# EAGLE design IVPSUALT (EAGLE 5.07)
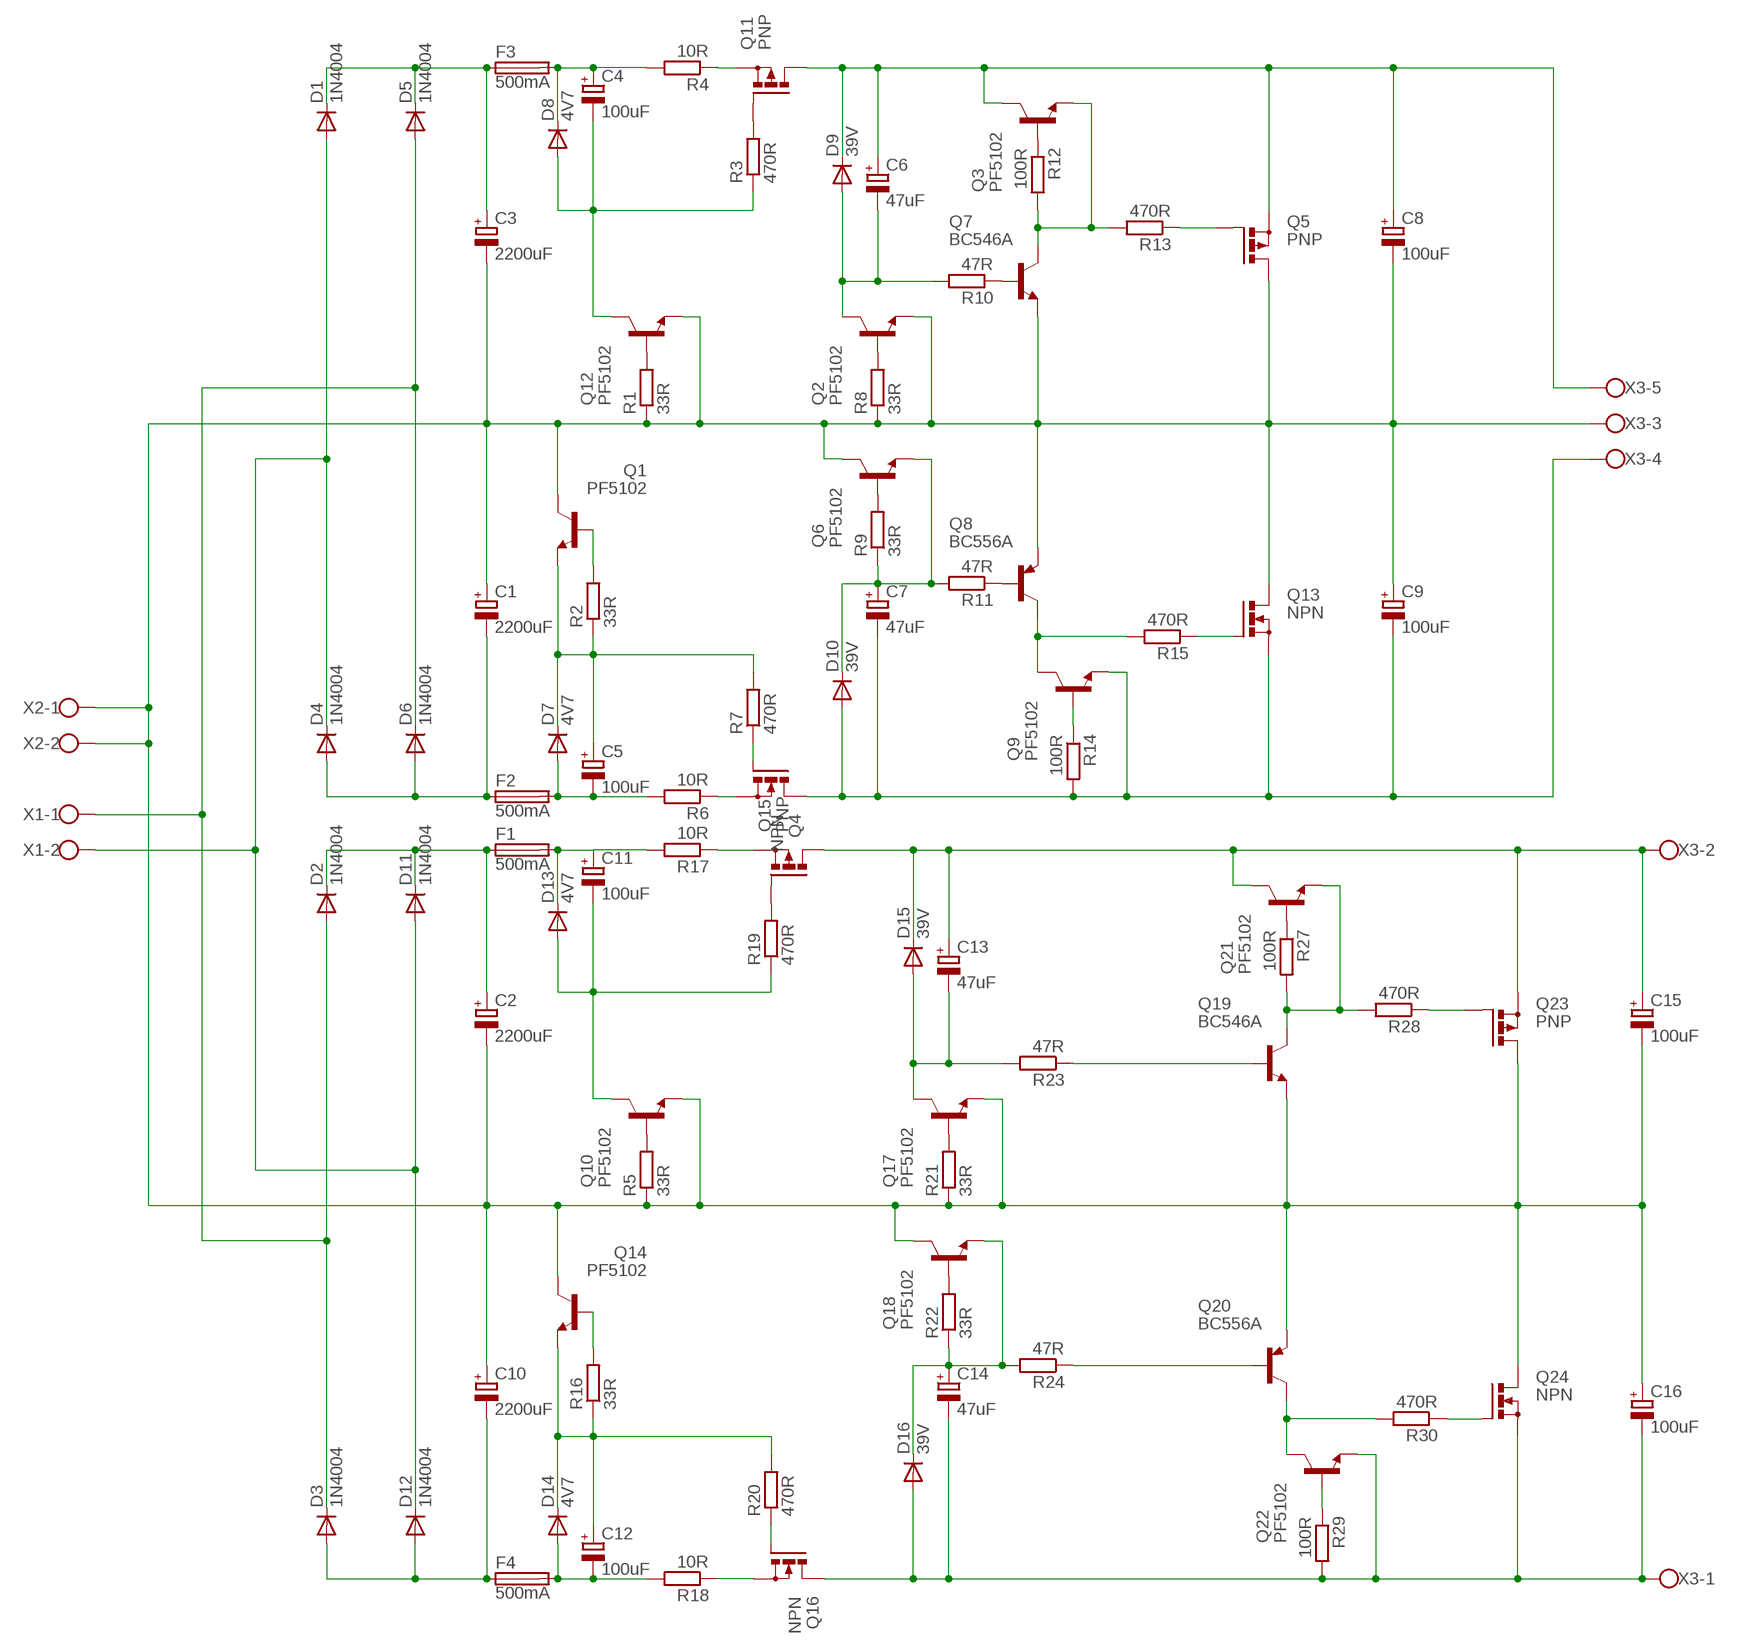
[diagram p0: schematic, sheet 1]

## Parts
C1  2200uF  CPOL-EUE7.5-18  [E7,5-18]
C2  2200uF  CPOL-EUE7.5-18  [E7,5-18]
C3  2200uF  CPOL-EUE7.5-18  [E7,5-18]
C4  100uF  CPOL-EUE3.5-8  [E3,5-8]
C5  100uF  CPOL-EUE3.5-8  [E3,5-8]
C6  47uF  CPOL-EUE3.5-8  [E3,5-8]
C7  47uF  CPOL-EUE3.5-8  [E3,5-8]
C8  100uF  CPOL-EUE7.5-18  [E7,5-18]
C9  100uF  CPOL-EUE7.5-18  [E7,5-18]
C10  2200uF  CPOL-EUE7.5-18  [E7,5-18]
C11  100uF  CPOL-EUE3.5-8  [E3,5-8]
C12  100uF  CPOL-EUE3.5-8  [E3,5-8]
C13  47uF  CPOL-EUE3.5-8  [E3,5-8]
C14  47uF  CPOL-EUE3.5-8  [E3,5-8]
C15  100uF  CPOL-EUE7.5-18  [E7,5-18]
C16  100uF  CPOL-EUE7.5-18  [E7,5-18]
D1  1N4004  [DO41-10]
D2  1N4004  [DO41-10]
D3  1N4004  [DO41-10]
D4  1N4004  [DO41-10]
D5  1N4004  [DO41-10]
D6  1N4004  [DO41-10]
D7  4V7  1N4004  [DO41-10]
D8  4V7  1N4004  [DO41-10]
D9  39V  1N4004  [DO41-10]
D10  39V  1N4004  [DO41-10]
D11  1N4004  [DO41-10]
D12  1N4004  [DO41-10]
D13  4V7  1N4004  [DO41-10]
D14  4V7  1N4004  [DO41-10]
D15  39V  1N4004  [DO41-10]
D16  39V  1N4004  [DO41-10]
F1  500mA  19560  [19560]
F2  500mA  19560  [19560]
F3  500mA  19560  [19560]
F4  500mA  19560  [19560]
Q1  PF5102  BCX59SMD  [TO92-EBC]
Q2  PF5102  BCX59SMD  [TO92-EBC]
Q3  PF5102  BCX59SMD  [TO92-EBC]
Q4  NPN  PMOSFET_NTO220BH  [TO220BH]
Q5  PNP  PMOSFET_PTO220BH  [TO220BH]
Q6  PF5102  BCX59SMD  [TO92-EBC]
Q7  BC546A  BC550B  [TO92-EBC]
Q8  BC556A  BC560  [TO92-EBC]
Q9  PF5102  BCX59SMD  [TO92-EBC]
Q10  PF5102  BCX59SMD  [TO92-EBC]
Q11  PNP  PMOSFET_PTO220BH  [TO220BH]
Q12  PF5102  BCX59SMD  [TO92-EBC]
Q13  NPN  PMOSFET_NTO220BH  [TO220BH]
Q14  PF5102  BCX59SMD  [TO92-EBC]
Q15  PNP  PMOSFET_PTO220BH  [TO220BH]
Q16  NPN  PMOSFET_NTO220BH  [TO220BH]
Q17  PF5102  BCX59SMD  [TO92-EBC]
Q18  PF5102  BCX59SMD  [TO92-EBC]
Q19  BC546A  BC550B  [TO92-EBC]
Q20  BC556A  BC560  [TO92-EBC]
Q21  PF5102  BCX59SMD  [TO92-EBC]
Q22  PF5102  BCX59SMD  [TO92-EBC]
Q23  PNP  PMOSFET_PTO220BH  [TO220BH]
Q24  NPN  PMOSFET_NTO220BH  [TO220BH]
R1  33R  R-EU_0204/7  [0204/7]
R2  33R  R-EU_0204/7  [0204/7]
R3  470R  R-EU_0204/7  [0204/7]
R4  10R  R-EU_0309/12  [0309/12]
R5  33R  R-EU_0204/7  [0204/7]
R6  10R  R-EU_0309/12  [0309/12]
R7  470R  R-EU_0204/7  [0204/7]
R8  33R  R-EU_0204/7  [0204/7]
R9  33R  R-EU_0204/7  [0204/7]
R10  47R  R-EU_0204/7  [0204/7]
R11  47R  R-EU_0204/7  [0204/7]
R12  100R  R-EU_0204/7  [0204/7]
R13  470R  R-EU_0204/7  [0204/7]
R14  100R  R-EU_0204/7  [0204/7]
R15  470R  R-EU_0204/7  [0204/7]
R16  33R  R-EU_0204/7  [0204/7]
R17  10R  R-EU_0309/12  [0309/12]
R18  10R  R-EU_0309/12  [0309/12]
R19  470R  R-EU_0204/7  [0204/7]
R20  470R  R-EU_0204/7  [0204/7]
R21  33R  R-EU_0204/7  [0204/7]
R22  33R  R-EU_0204/7  [0204/7]
R23  47R  R-EU_0204/7  [0204/7]
R24  47R  R-EU_0204/7  [0204/7]
R27  100R  R-EU_0204/7  [0204/7]
R28  470R  R-EU_0204/7  [0204/7]
R29  100R  R-EU_0204/7  [0204/7]
R30  470R  R-EU_0204/7  [0204/7]
X1  W237-02P  [W237-132]
X2  W237-02P  [W237-132]
X3  W237-05P  [W237-5P]

## Nets
N$1: D2.A D3.C D5.A D6.C X1.1
N$2: Q12.B R1.2
N$3: C11.- D13.A Q10.C R19.1
N$4: C2.+ D2.C D11.C F1.1
N$5: C10.- D3.A D12.A F4.1
N$6: D1.A D4.C D11.A D12.C X1.2
N$7: Q2.B R8.2
N$8: C3.+ D1.C D5.C F3.1
N$9: C4.+ D8.C F3.2 R4.2
N$10: C5.- D7.A F2.2 R6.2
N$11: C4.- D8.A Q12.C R3.1
N$12: Q3.B R12.1
N$13: Q11.G R3.2
N$14: C5.+ D7.C Q1.E R2.1 R7.2
N$15: Q11.S R4.1
N$16: Q1.B R2.2
N$17: Q4.G R7.1
N$18: Q4.S R6.1
N$19: Q3.E Q7.C R12.2 R13.2
N$20: C7.- C9.- D10.A Q4.D Q9.E Q13.S R14.2 X3.4
N$21: Q6.B R9.2
N$22: C6.- D9.A Q2.C R10.2
N$23: Q9.B R14.1
N$24: C7.+ D10.C Q6.E R9.1 R11.2
N$25: Q7.B R10.1
N$26: Q8.B R11.1
N$27: C14.- C16.- D16.A Q16.D Q22.E Q24.S R29.2 X3.1
N$28: C12.+ D14.C Q14.E R16.1 R20.2
N$29: Q14.B R16.2
N$30: Q8.C Q9.C R15.2
N$31: Q5.G R13.1
N$32: Q13.G R15.1
N$33: C6.+ C8.+ D9.C Q3.C Q5.S Q11.D X3.5
N$34: Q15.S R17.1
N$35: Q16.S R18.1
N$36: C13.- D15.A Q17.C R23.2
N$37: C12.- D14.A F4.2 R18.2
N$38: Q19.B R23.1
N$39: Q10.B R5.2
N$40: C11.+ D13.C F1.2 R17.2
N$41: C14.+ D16.C Q18.E R22.1 R24.2
N$42: Q20.B R24.1
N$43: C1.- D4.A D6.A F2.1
N$44: Q24.G R30.1
N$45: Q15.G R19.2
N$46: Q16.G R20.1
N$48: Q17.B R21.2
N$49: Q18.B R22.2
N$51: Q20.C Q22.C R30.2
N$52: Q23.G R28.1
N$53: C13.+ C15.+ D15.C Q15.D Q21.C Q23.S X3.2
N$54: Q21.B R27.1
N$55: Q19.C Q21.E R27.2 R28.2
N$56: Q22.B R29.1
N$57: C1.+ C2.- C3.- C8.- C9.+ C10.+ C15.- C16.+ Q1.C Q2.E Q5.D Q6.C Q7.E Q8.E Q10.E Q12.E Q13.D Q14.C Q17.E Q18.C Q19.E Q20.E Q23.D Q24.D R1.1 R5.1 R8.1 R21.1 X2.1 X2.2 X3.3

## Library data of the parts
C1-C16 = resistor:CPOL-EU: POLARIZED CAPACITOR, European symbol
D1-D16 = diode:1N4004: DIODE general purpose rectifier, 1 A
F1-F4 = fuse:19560: FUSE HOLDER TR5, Wickmann
Q1-Q3 Q6 Q9 Q10 Q12 Q14 Q17 Q18 Q21 Q22 = transistor-npn:BCX59*: NPN Transistor
Q4 Q13 Q16 Q24 = transistor-power:PMOSFET_N: Power MOSFET N-Channel
Q5 Q11 Q15 Q23 = transistor-power:PMOSFET_P: Power MOSFET P-Channel
Q7 Q19 = transistor-npn:BC550*: NPN Transistor
Q8 Q20 = transistor-pnp:BC560*: PNP Transistror
R1-R24 R27-R30 = resistor:R-EU_: RESISTOR, European symbol
X1 X2 = con-wago-508:W237-02P: WAGO SREW CLAMP
X3 = con-wago-508:W237-05P: WAGO SREW CLAMP

## Board
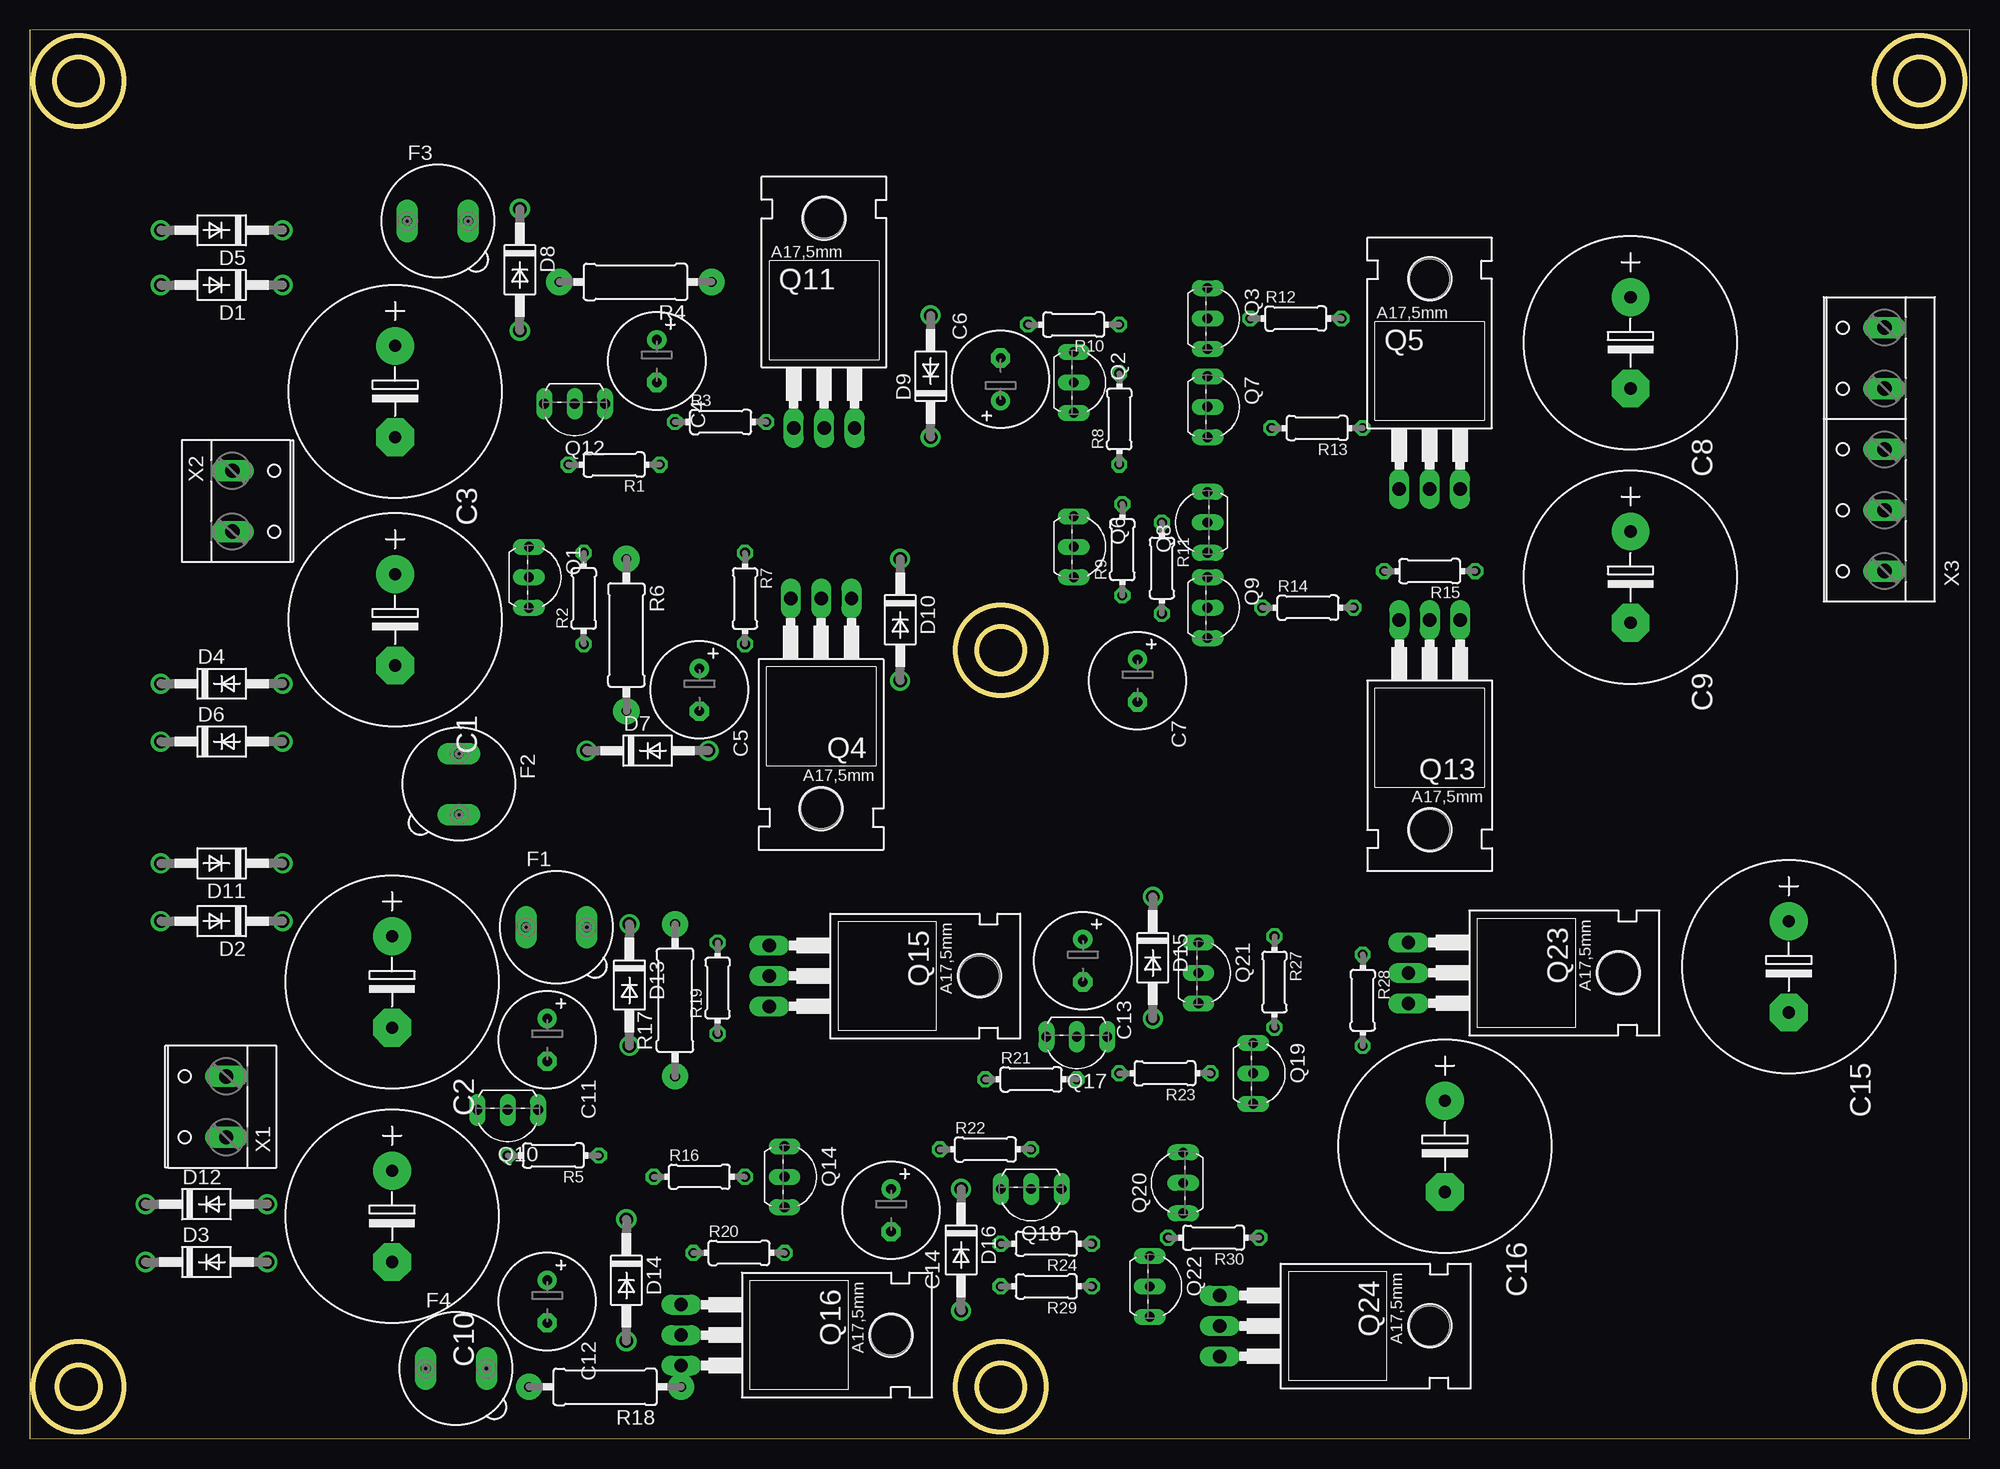
[diagram p1: board, top side]
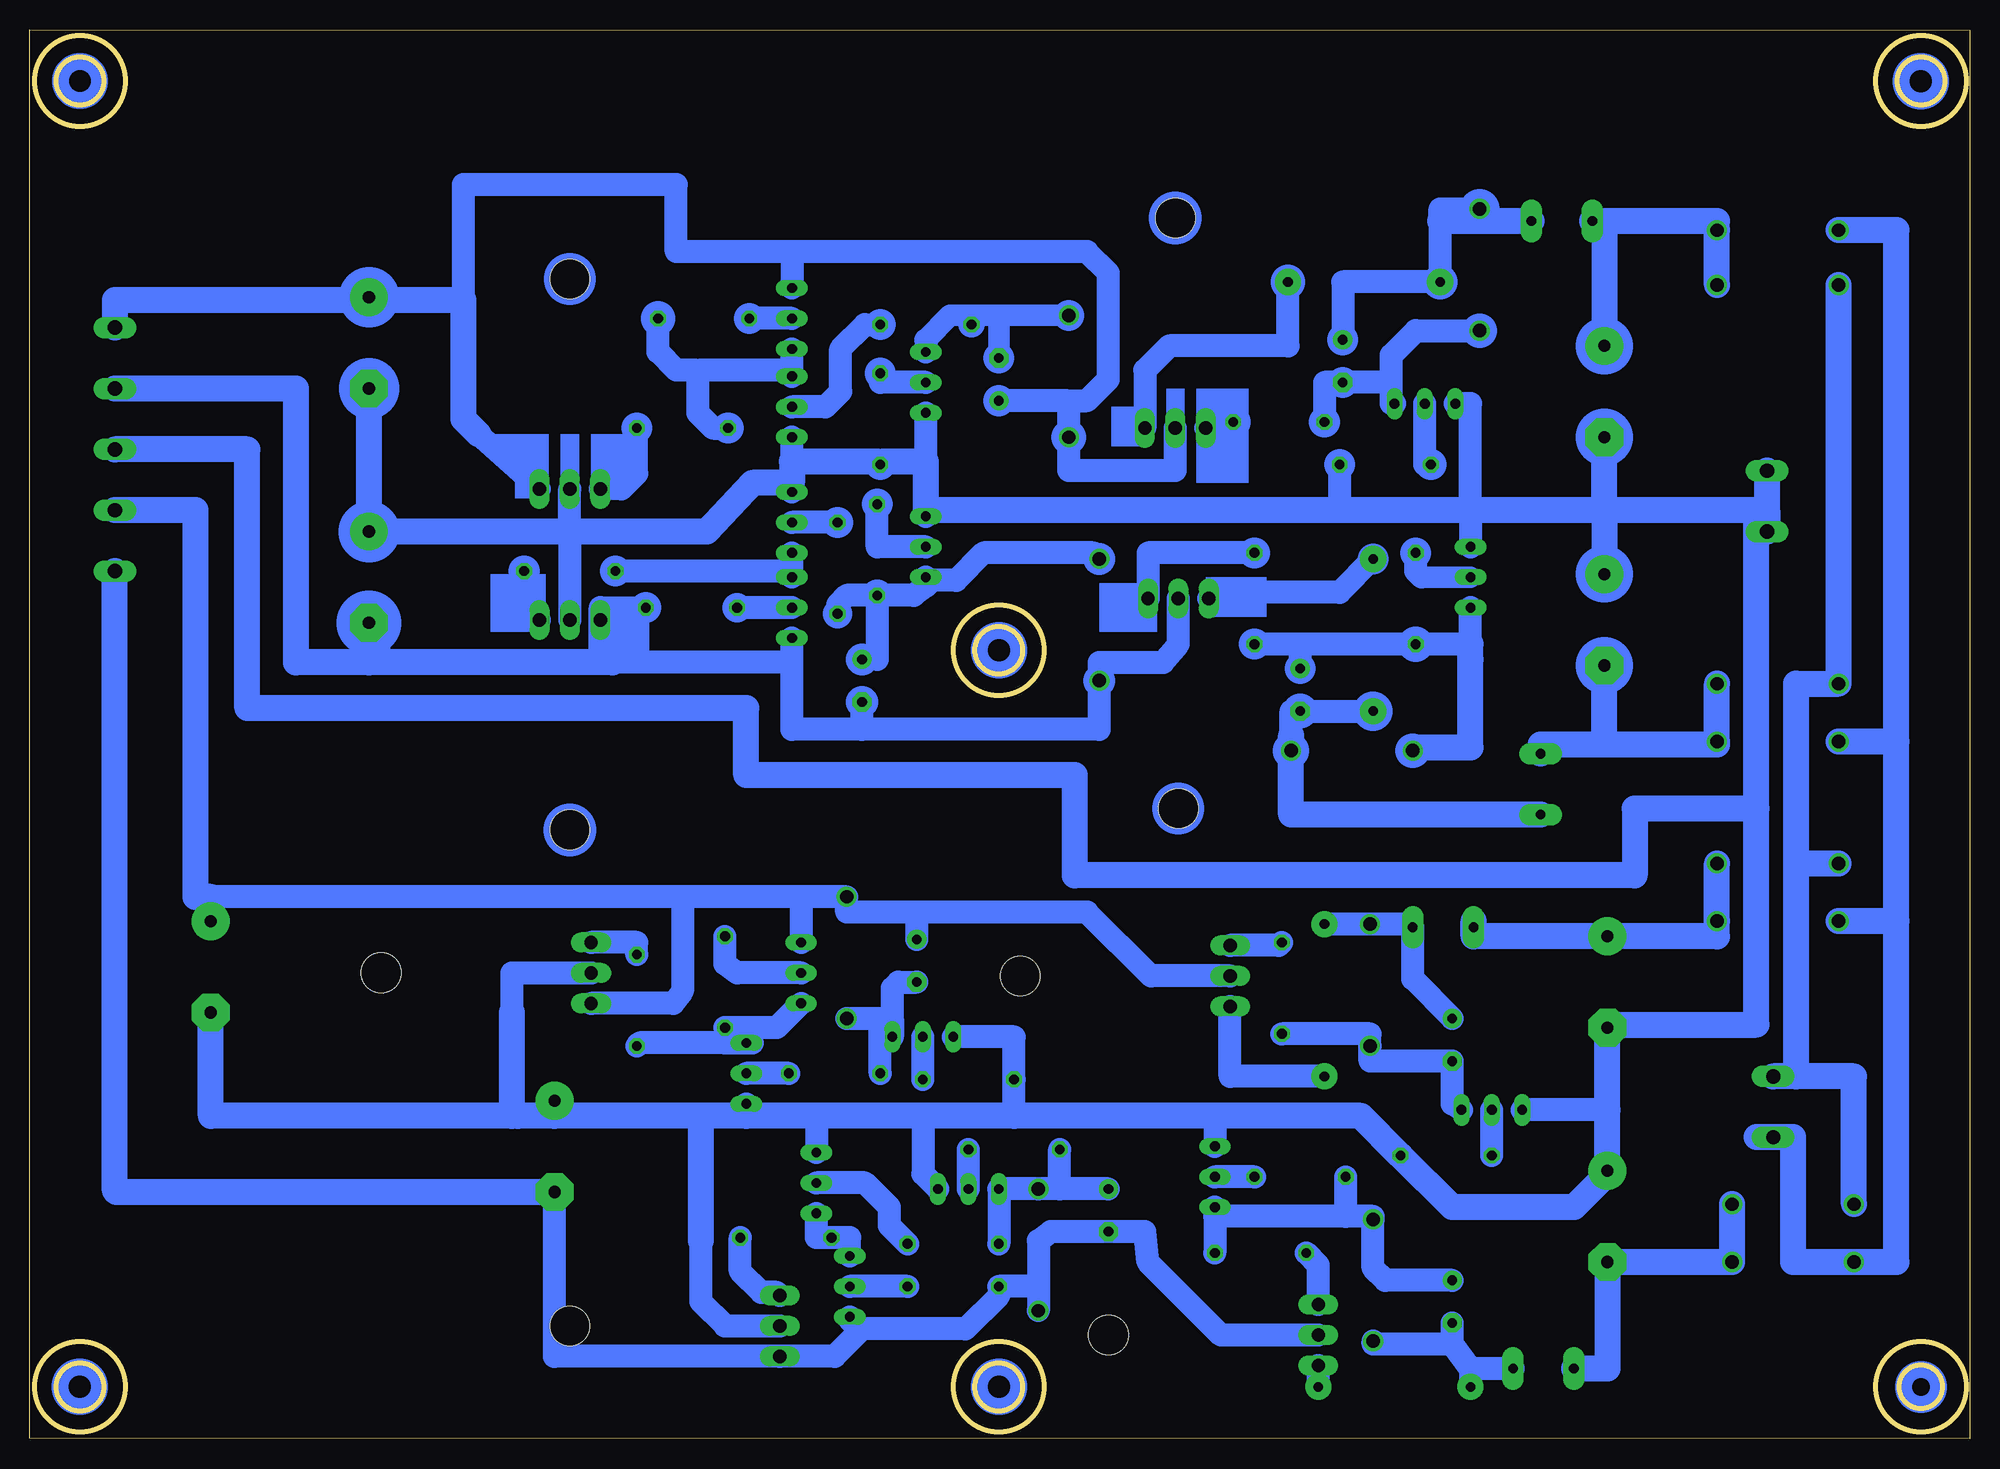
[diagram p2: board, bottom side, seen from below]

Size 161.91 x 117.55 mm. Coordinates in mm from the lower left corner, seen from the top.
Outline: 0,0 161.91,0.03 161.91,117.55 0,117.53 0,0
Outline: circle at 4.06,113.28 radius 3.78
Outline: circle at 157.73,113.28 radius 3.78
Outline: circle at 4.06,4.32 radius 3.78
Outline: circle at 157.73,4.32 radius 3.78
Outline: circle at 157.73,4.32 radius 1.98
Outline: circle at 4.06,113.28 radius 1.98
Outline: circle at 157.73,113.28 radius 1.98
Outline: circle at 4.06,4.32 radius 1.8
Outline: circle at 81.03,4.32 radius 3.78
Outline: circle at 81.03,4.32 radius 1.98
Outline: circle at 81.03,65.79 radius 3.78
Outline: circle at 81.03,65.79 radius 1.98
Copper layers (1*16): Top 0.035mm / dielectric 1.5mm / Bottom 0.035mm
Design rules "default": minimum track width 10mil, minimum drill 24mil, track to track 8mil, track to pad 8mil, pad to pad 8mil, via to via 8mil, smd to smd 8mil, copper to edge 40mil, drill to drill 8mil, minimum pad ring 10mil, minimum via ring 8mil, stop-mask expansion 4mil, vias tented up to drill 0mil, thermal gap 10mil

### Footprints (pad centres in the part's own frame; a part is rotated, then mirrored left to right if it is on the bottom)
E7,5-18 = drill 1.016 pad 3.15 round: + -3.81,0 | drill 1.016 pad 3.15 octagon: - 3.81,0
E3,5-8 = drill 0.813 pad 1.6 round: + -1.778,0 | drill 0.813 pad 1.6 octagon: - 1.778,0
DO41-10 = drill 1.118 round: A 5.08,0; C -5.08,0
19560 = drill 0.813 pad 1.778 long: 1 -2.54,0; 2 2.54,0
TO92-EBC = drill 0.813 long: B 0,-1.27; C -2.54,-1.27; E 2.54,-1.27
TO220BH = drill 1.118 long: D 0,-6.35; G -2.54,-6.35; S 2.54,-6.35 | hole 3.302: 0,11.176
0204/7 = drill 0.813 octagon: 1 -3.81,0; 2 3.81,0
0309/12 = drill 0.8 pad 2.184 round: 1 -6.35,0; 2 6.35,0
W237-132 = drill 1.194 long: 1 -2.54,-0.635; 2 2.54,-0.635
W237-5P = drill 1.194 long: 1 -10.16,-0.635; 2 -5.08,-0.635; 3 0,-0.635; 4 5.08,-0.635; 5 10.16,-0.635

### Placement (x,y rotation side)
C1  30.48,68.33 270 top
C2  30.23,38.1 270 top
C3  30.48,87.38 270 top
C4  52.32,89.92 270 top
C5  55.88,62.48 270 top
C6  81.03,88.39 90 top
C7  92.46,63.25 270 top
C8  133.6,91.44 270 top
C9  133.6,71.88 270 top
C10  30.23,18.54 270 top
C11  43.18,33.27 270 top
C12  43.18,11.43 270 top
C13  87.88,39.88 270 top
C14  71.88,19.05 270 top
C15  146.81,39.37 270 top
C16  118.11,24.38 270 top
D1  16,96.27 180 top
D2  16,43.18 180 top
D3  14.73,14.73 0 top
D4  16,62.99 0 top
D5  16,100.84 180 top
D6  16,58.17 0 top
D7  51.56,57.4 0 top
D8  40.89,97.54 270 top
D9  75.18,88.65 90 top
D10  72.64,68.33 270 top
D11  16,48.01 180 top
D12  14.73,19.56 0 top
D13  50.04,37.85 270 top
D14  49.78,13.21 270 top
D15  93.73,40.13 270 top
D16  77.72,15.75 270 top
F1  43.94,42.67 0 top
F2  35.81,54.61 270 top
F3  34.04,101.6 0 top
F4  35.56,5.84 0 top
Q1  42.93,71.88 270 top
Q2  88.39,88.14 270 top
Q3  99.57,93.47 270 top
Q4  66.04,63.75 180 top
Q5  116.84,85.6 0 top
Q6  88.39,74.42 270 top
Q7  99.57,86.11 270 top
Q8  97.03,76.45 90 top
Q9  99.57,69.34 270 top
Q10  39.88,26.16 180 top
Q11  66.29,90.68 0 top
Q12  45.47,85.09 180 top
Q13  116.84,61.98 180 top
Q14  64.26,21.84 270 top
Q15  68.07,38.61 270 top
Q16  60.71,8.64 270 top
Q17  87.38,32.26 180 top
Q18  83.57,19.56 180 top
Q19  103.38,30.48 270 top
Q20  95,21.34 90 top
Q21  98.81,38.86 270 top
Q22  94.74,12.7 270 top
Q23  121.41,38.86 270 top
Q24  105.66,9.4 270 top
R1  48.77,81.28 180 top
R2  46.23,70.1 90 top
R3  57.66,84.84 0 top
R4  50.55,96.52 180 top
R5  43.69,23.62 180 top
R6  49.78,67.06 270 top
R7  59.69,70.1 270 top
R8  90.93,85.09 90 top
R9  91.19,74.17 90 top
R10  87.12,92.96 180 top
R11  94.49,72.64 270 top
R12  105.66,93.47 0 top
R13  107.44,84.33 180 top
R14  106.68,69.34 0 top
R15  116.84,72.39 180 top
R16  55.88,21.84 0 top
R17  53.85,36.58 90 top
R18  48.01,4.32 180 top
R19  57.4,37.59 90 top
R20  59.18,15.49 0 top
R21  83.57,29.97 0 top
R22  79.76,24.13 0 top
R23  94.74,30.48 180 top
R24  84.84,16.26 180 top
R27  103.89,38.1 270 top
R28  111.25,36.58 270 top
R29  84.84,12.7 180 top
R30  98.81,16.76 180 top
X1  15.75,27.69 90 top
X2  17.53,78.23 270 top
X3  154.18,82.55 90 top

### Tracks (layer width: path | path; a pad name or v marks a point on that pad's centre or on a via)
N$1
  Bottom 2.184: D5.A 6.1,100.84 6.1,58.17 | 6.1,43.18 6.1,58.17 | 6.1,58.17 D6.C | 6.1,43.18 D2.A | 6.1,43.18 6.1,14.73 D3.C 14.73,14.73 14.73,25.15 X1.1 17.78,25.15
N$2
  Bottom 1.93: Q12.B 45.47,81.28 R1.2
N$3
  Bottom 1.93: Q10.C 43.18,27.94 C11.- 50.04,31.5 D13.A 50.04,33.78 R19.1
N$4
  Bottom 2.184: D11.C D2.C 21.08,41.91 C2.+ 41.4,41.91 F1.1 41.4,43.18
N$5
  Bottom 2.184: D12.A D3.A C10.- 30.23,5.84 F4.1
N$6
  Bottom 2.184: 14.48,48.01 D11.A | 14.48,48.01 14.48,62.99 D4.C D1.A | 14.48,30.23 14.48,48.01 | 14.48,30.23 X1.2 | 14.48,30.23 9.65,30.23 D12.C
N$7
  Bottom 1.93: Q2.B 90.93,88.14 R8.2
N$8
  Bottom 2.184: 30.48,101.6 C3.+ | 30.48,101.6 F3.1 | D1.C D5.C 21.08,101.6 30.48,101.6
N$9
  Bottom 1.93: D8.C 44.2,102.62 44.2,101.6 R4.2 52.32,96.52 C4.+
  Bottom 2.184: F3.2 44.2,101.6
N$10
  Bottom 1.93: D7.A 56.64,58.67 56.64,60.71 C5.- R6.2
  Bottom 2.184: F2.2 56.64,52.07 56.64,58.67
N$11
  Bottom 1.93: R3.1 53.85,88.14 C4.- 48.26,88.14 | D8.A 46.23,92.46 48.26,90.42 48.26,88.65 48.26,88.14 | Q12.C 48.26,86.36 48.26,88.14
N$12
  Bottom 1.93: Q3.B R12.1
N$13
  Bottom 1.93: R3.2 Q11.G
N$14
  Bottom 1.93: 41.66,66.29 R2.1 55.88,66.29 | 55.88,66.29 R7.2 | 55.88,66.29 C5.+ | 46.23,57.66 D7.C | 41.66,65.02 Q1.E
  Bottom 2.184: 46.23,57.66 41.66,57.66 41.66,65.02 41.66,66.29
N$15
  Bottom 1.93: Q11.S 68.83,89.15 66.8,91.19 56.9,91.19 R4.1
N$16
  Bottom 1.778: Q1.B 45.72,71.88
  Bottom 1.93: 45.72,71.88 46.23,72.39 R2.2
N$17
  Bottom 1.93: R7.1 68.58,73.91 Q4.G
N$18
  Bottom 1.93: R6.1 52.58,70.61 62.74,70.61 63.25,70.1 Q4.S
N$19
  Bottom 1.93: Q7.C 98.3,89.15 | R13.2 104.9,84.33 106.17,85.6 106.17,88.9 | 106.17,88.9 105.92,89.15 98.3,89.15 | 106.17,88.9 106.43,89.15 107.95,89.15 109.47,90.68 R12.2 | 98.3,89.15 Q3.E
N$20
  Bottom 1.93: Q4.D 66.04,66.29 67.31,64.77 72.64,64.77 D10.A 72.64,59.18 92.46,59.18 | 98.3,64.77 113.28,64.77 114.3,64.77 Q13.S 114.3,69.34 R14.2 | 92.46,59.18 98.3,59.18 98.3,64.77 | 98.3,64.77 Q9.E | 92.46,59.18 C7.-
  Bottom 2.184: 133.6,64.77 C9.- | 113.28,64.77 133.6,64.77 | X3.4 139.7,87.63 139.7,64.77 133.6,64.77
N$21
  Bottom 1.93: Q6.B 91.19,74.42 R9.2
N$22
  Bottom 1.778: D9.A 81.03,93.73 | 81.03,93.73 83.31,93.73 | 83.31,93.73 85.09,93.73 87.12,91.69 | 83.31,93.73 R10.2 | 81.03,93.73 C6.-
  Bottom 1.93: 87.12,91.69 Q2.C
N$23
  Bottom 1.93: Q9.B R14.1
N$24
  Bottom 1.93: 87.12,71.12 88.14,70.36 R9.1 | R11.2 94.49,69.6 93.73,70.36 R9.1 | D10.C 72.64,73.66 73.15,73.91 82.3,73.91 84.58,71.63 86.61,71.63 87.12,71.12 | C7.+ 91.19,65.02 R9.1 | 87.12,71.12 Q6.E
N$25
  Bottom 1.93: R10.1 92.2,92.96 94.23,90.93 94.23,87.38 95.5,86.11 Q7.B
N$26
  Bottom 1.93: R11.1 Q8.B
N$27
  Bottom 1.93: Q16.D 62.48,8.64 68.58,14.73 68.83,17.27 C14.- 76.71,17.27 77.72,16.51 77.72,12.7 | 77.72,12.7 D16.A | 77.72,12.7 R29.2 81.03,11.94 83.82,9.14 92.46,9.14 | 92.46,9.14 92.71,9.14 93.47,9.91 Q22.E | 92.46,9.14 94.74,6.86 Q24.S 118.11,6.86 C16.-
  Bottom 2.184: C16.- 154.69,20.57 154.81,20.7 X3.1
N$28
  Bottom 1.93: 52.07,18.54 49.78,18.54 D14.C 49.78,14.22 48.77,13.21 C12.+ | 52.07,18.54 R16.1 | 52.07,18.54 62.99,18.54 | 62.99,18.54 Q14.E | 62.99,18.54 R20.2
N$29
  Bottom 1.93: R16.2 Q14.B
N$30
  Bottom 1.93: 98.3,72.39 Q8.C | 98.3,72.39 R15.2 | Q9.C 98.3,72.39
N$31
  Bottom 1.93: Q5.G 112.52,79.25 111.25,80.52 R13.1
N$32
  Bottom 1.93: Q13.G 120.4,68.33 120.65,68.58 R15.1
N$33
  Bottom 1.93: 75.44,86.61 75.18,85.6 D9.C 75.18,80.77 66.29,80.77 Q11.D | 75.44,86.61 C6.+ | 75.44,86.61 73.66,86.61 71.88,88.39 71.88,97.28 73.66,99.06 98.3,99.06 | 98.3,99.06 107.95,99.06 107.95,104.65 125.73,104.65 125.73,95 | 124.46,83.82 Q5.S | 98.3,99.06 Q3.C
  Bottom 2.184: 133.6,95 125.73,95 125.73,85.09 124.46,83.82 | 133.6,95 C8.+ | 133.6,95 154.81,95 X3.5
N$34
  Bottom 1.93: R17.1 61.72,30.23 Q15.S
N$35
  Bottom 1.93: R18.1 Q16.S
N$36
  Bottom 1.93: C13.- 89.41,38.1 89.92,37.59 89.92,35.05 | 89.92,35.05 Q17.C | 90.93,35.05 89.92,35.05 | 90.93,35.05 D15.A | R23.2 90.93,35.05
N$37
  Bottom 1.93: F4.2 41.66,5.84 | 41.66,5.84 43.18,7.87 | 43.18,7.87 49.78,7.87 D14.A | 43.18,7.87 C12.- | 41.66,5.84 R18.2
N$38
  Bottom 1.93: R23.1 Q19.B
N$39
  Bottom 1.93: R5.2 Q10.B
N$40
  Bottom 1.93: C11.+ 46.48,38.35 F1.2 46.74,42.93 46.99,42.93 D13.C R17.2
N$41
  Bottom 1.93: C14.+ 75.95,20.83 | 75.95,20.83 D16.C Q18.E R24.2 | 75.95,20.83 R22.1
N$42
  Bottom 1.93: R24.1 90.17,17.78 90.17,19.3 92.2,21.34 Q20.B
N$43
  Bottom 2.184: D4.A D6.A 21.08,57.91 30.48,57.91 | 30.48,57.91 C1.- | F2.1 35.81,57.91 30.48,57.91
N$44
  Bottom 1.93: Q24.G 99.57,12.19 100.84,12.19 102.62,13.97 R30.1
N$45
  Bottom 1.93: R19.2 57.66,41.15 Q15.G
N$46
  Bottom 1.93: R20.1 54.36,14.48 Q16.G
N$48
  Bottom 1.93: R21.2 Q17.B
N$49
  Bottom 1.93: Q18.B R22.2
N$51
  Bottom 1.93: Q22.C 93.47,16.76 R30.2 96.27,16.76 Q20.C
N$52
  Bottom 1.93: Q23.G 111.25,41.4 R28.1
N$53
  Bottom 1.93: Q15.D 68.33,38.61 73.66,43.94 87.88,43.94 | 87.88,43.94 93.73,43.94 D15.C 97.54,45.21 | 87.88,43.94 C13.+ | 97.54,45.21 Q21.C | Q23.S 108.2,36.32 107.44,37.34 107.44,45.21 | 97.54,45.21 107.44,45.21 | C15.+ 146.81,45.21 107.44,45.21
  Bottom 2.184: X3.2 148.08,77.47 148.08,45.21 146.81,45.21
N$54
  Bottom 1.93: Q21.B 102.87,38.86 103.89,39.62 R27.1
N$55
  Bottom 1.93: R28.2 111,33.02 103.89,33.02 | 103.89,33.02 Q19.C 101.6,33.02 | 103.89,33.02 R27.2 99.57,34.29 Q21.E
N$56
  Bottom 1.93: R29.1 Q22.B
N$57
  Bottom 1.93: 87.12,81.28 87.12,81.53 Q2.E | 98.3,79.76 Q8.E | Q13.D 116.84,75.69 Q5.D | 98.3,81.53 Q7.E | 52.58,77.47 R1.1 | 42.67,86.36 Q12.E 41.66,86.36 41.66,77.47 Q1.C | 87.12,77.47 Q6.C | 30.23,27.43 Q10.E | 62.99,26.92 Q14.C | Q17.E 79.76,33.53 R21.1 79.76,26.92 | Q18.C 87.38,22.1 87.38,26.92 | 96.27,26.92 Q20.E | 102.11,26.92 Q19.E | Q24.D 103.89,9.4 105.92,11.43 105.92,16.51 | Q23.D 121.67,38.86 121.67,35.56 | 117.86,27.94 C16.+
  Bottom 2.184: 87.12,81.28 87.12,77.47 52.58,77.47 41.66,77.47 30.48,77.47 | 87.12,81.53 90.68,81.53 R8.1 91.19,81.53 98.3,81.53 98.3,79.76 101.6,79.76 105.41,75.69 116.84,75.69 C9.+ C8.- | 30.48,77.47 C3.- | 30.48,71.37 C1.+ 30.48,77.47 | 17.78,77.47 30.48,77.47 | 17.78,52.58 17.78,34.54 30.23,34.54 C2.- 30.23,27.43 C10.+ 30.23,22.1 33.02,19.3 43.18,19.3 R5.1 50.8,26.92 62.99,26.92 79.76,26.92 87.38,26.92 96.27,26.92 102.11,26.92 105.92,26.92 | 16.89,77.47 X2.2 | 16.89,77.47 X2.1 | 17.78,77.47 16.89,77.47 | X3.3 143.76,82.55 143.76,60.96 102.11,60.96 102.11,55.37 74.68,55.37 74.68,46.99 27.94,46.99 27.94,52.58 17.78,52.58 | 17.78,52.58 17.78,77.47 | 105.92,26.92 105.92,16.51 | 105.92,26.92 118.11,26.92 | 118.11,26.92 121.16,26.92 121.67,26.92 | 121.67,26.92 121.67,35.56 | 117.86,27.94 118.11,27.69 118.11,26.92 | C15.- 146.81,26.92 121.67,26.92
(copper drawn outside any net)
  shapes: Bottom area x19, Bottom circle x67